# EAGLE design dual_wbo (EAGLE 8.5.1)

## Sheet 1 of 7: MCU
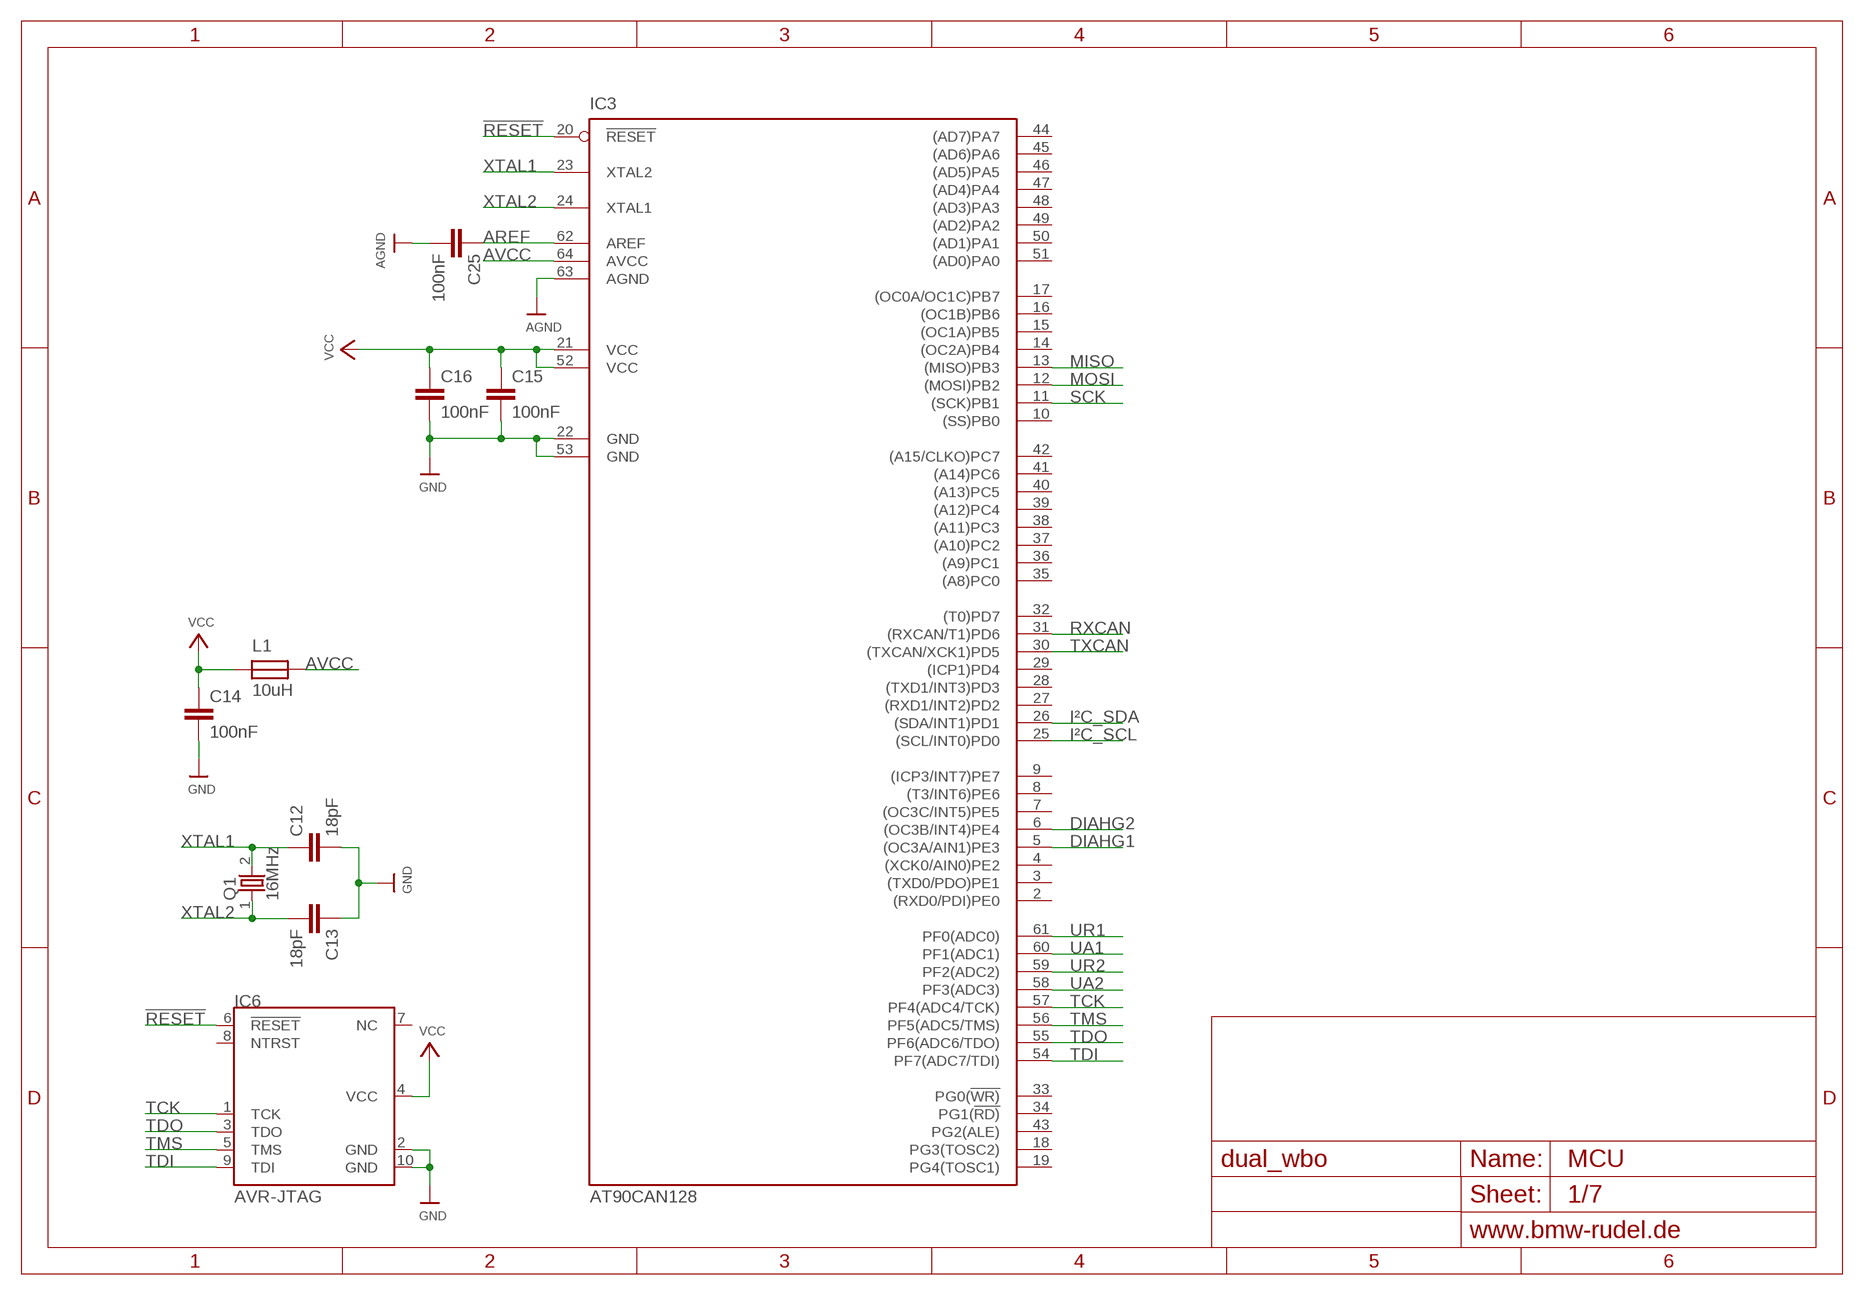
[diagram p0: schematic, sheet 1]

### Parts
C12  18pF  C-EUC0603  [C0603]
C13  18pF  C-EUC0603  [C0603]
C14  100nF  C-EUC0603  [C0603]
C15  100nF  C-EUC0603  [C0603]
C16  100nF  C-EUC0603  [C0603]
C25  100nF  C-EUC0603  [C0603]
IC3  AT90CAN128  [TQFP64]
IC6  AVR-JTAG  [2X05_1.27MM_SMT]
L1  10uH  FERRITE0603  [R0603]
Q1  16MHz  ABM3  [ABM3]

### Nets
!RESET: IC3.20(!RESET) IC6.6(!RESET)
AGND: C25.2 IC3.63(AGND) ; also sheet 2,3,6
AREF: C25.1 IC3.62(AREF) ; also sheet 2,3,6
AVCC: IC3.64(AVCC) L1.2
DIAHG1: IC3.5((OC3A/AIN1)PE3) ; also sheet 2,4
DIAHG2: IC3.6((OC3B/INT4)PE4) ; also sheet 3,4
GND: C12.2 C13.1 C14.2 C15.2 C16.2 IC3.22(GND) IC3.53(GND) IC6.2(GND) IC6.10(GND) ; also sheet 2,3,4,5,6
I²C_SCL: IC3.25((SCL/INT0)PD0) ; also sheet 5
I²C_SDA: IC3.26((SDA/INT1)PD1) ; also sheet 5
MISO: IC3.13((MISO)PB3) ; also sheet 2,3
MOSI: IC3.12((MOSI)PB2) ; also sheet 2,3
RXCAN: IC3.31((RXCAN/T1)PD6) ; also sheet 5
SCK: IC3.11((SCK)PB1) ; also sheet 2,3
TCK: IC3.57(PF4(ADC4/TCK)) IC6.1(TCK)
TDI: IC3.54(PF7(ADC7/TDI)) IC6.9(TDI)
TDO: IC3.55(PF6(ADC6/TDO)) IC6.3(TDO)
TMS: IC3.56(PF5(ADC5/TMS)) IC6.5(TMS)
TXCAN: IC3.30((TXCAN/XCK1)PD5) ; also sheet 5
UA1: IC3.60(PF1(ADC1)) ; also sheet 2
UA2: IC3.58(PF3(ADC3)) ; also sheet 3
UR1: IC3.61(PF0(ADC0)) ; also sheet 2
UR2: IC3.59(PF2(ADC2)) ; also sheet 3
VCC: C14.1 C15.1 C16.1 IC3.21(VCC) IC3.52(VCC) IC6.4(VCC) L1.1 ; also sheet 2,3,5,6
XTAL1: C12.1 IC3.23(XTAL2) Q1.2
XTAL2: C13.2 IC3.24(XTAL1) Q1.1
Unconnected: IC3.2((RXD0/PDI)PE0) IC3.3((TXD0/PDO)PE1) IC3.4((XCK0/AIN0)PE2) IC3.7((OC3C/INT5)PE5) IC3.8((T3/INT6)PE6) IC3.9((ICP3/INT7)PE7) IC3.10((SS)PB0) IC3.14((OC2A)PB4) IC3.15((OC1A)PB5) IC3.16((OC1B)PB6) IC3.17((OC0A/OC1C)PB7) IC3.18(PG3(TOSC2)) IC3.19(PG4(TOSC1)) IC3.27((RXD1/INT2)PD2) IC3.28((TXD1/INT3)PD3) IC3.29((ICP1)PD4) IC3.32((T0)PD7) IC3.33(PG0(!WR)) IC3.34(PG1(!RD)) IC3.35((A8)PC0) IC3.36((A9)PC1) IC3.37((A10)PC2) IC3.38((A11)PC3) IC3.39((A12)PC4) IC3.40((A13)PC5) IC3.41((A14)PC6) IC3.42((A15/CLKO)PC7) IC3.43(PG2(ALE)) IC3.44((AD7)PA7) IC3.45((AD6)PA6) IC3.46((AD5)PA5) IC3.47((AD4)PA4) IC3.48((AD3)PA3) IC3.49((AD2)PA2) IC3.50((AD1)PA1) IC3.51((AD0)PA0) IC6.7(NC) IC6.8(NTRST)

## Sheet 2 of 7: CJ125 #1
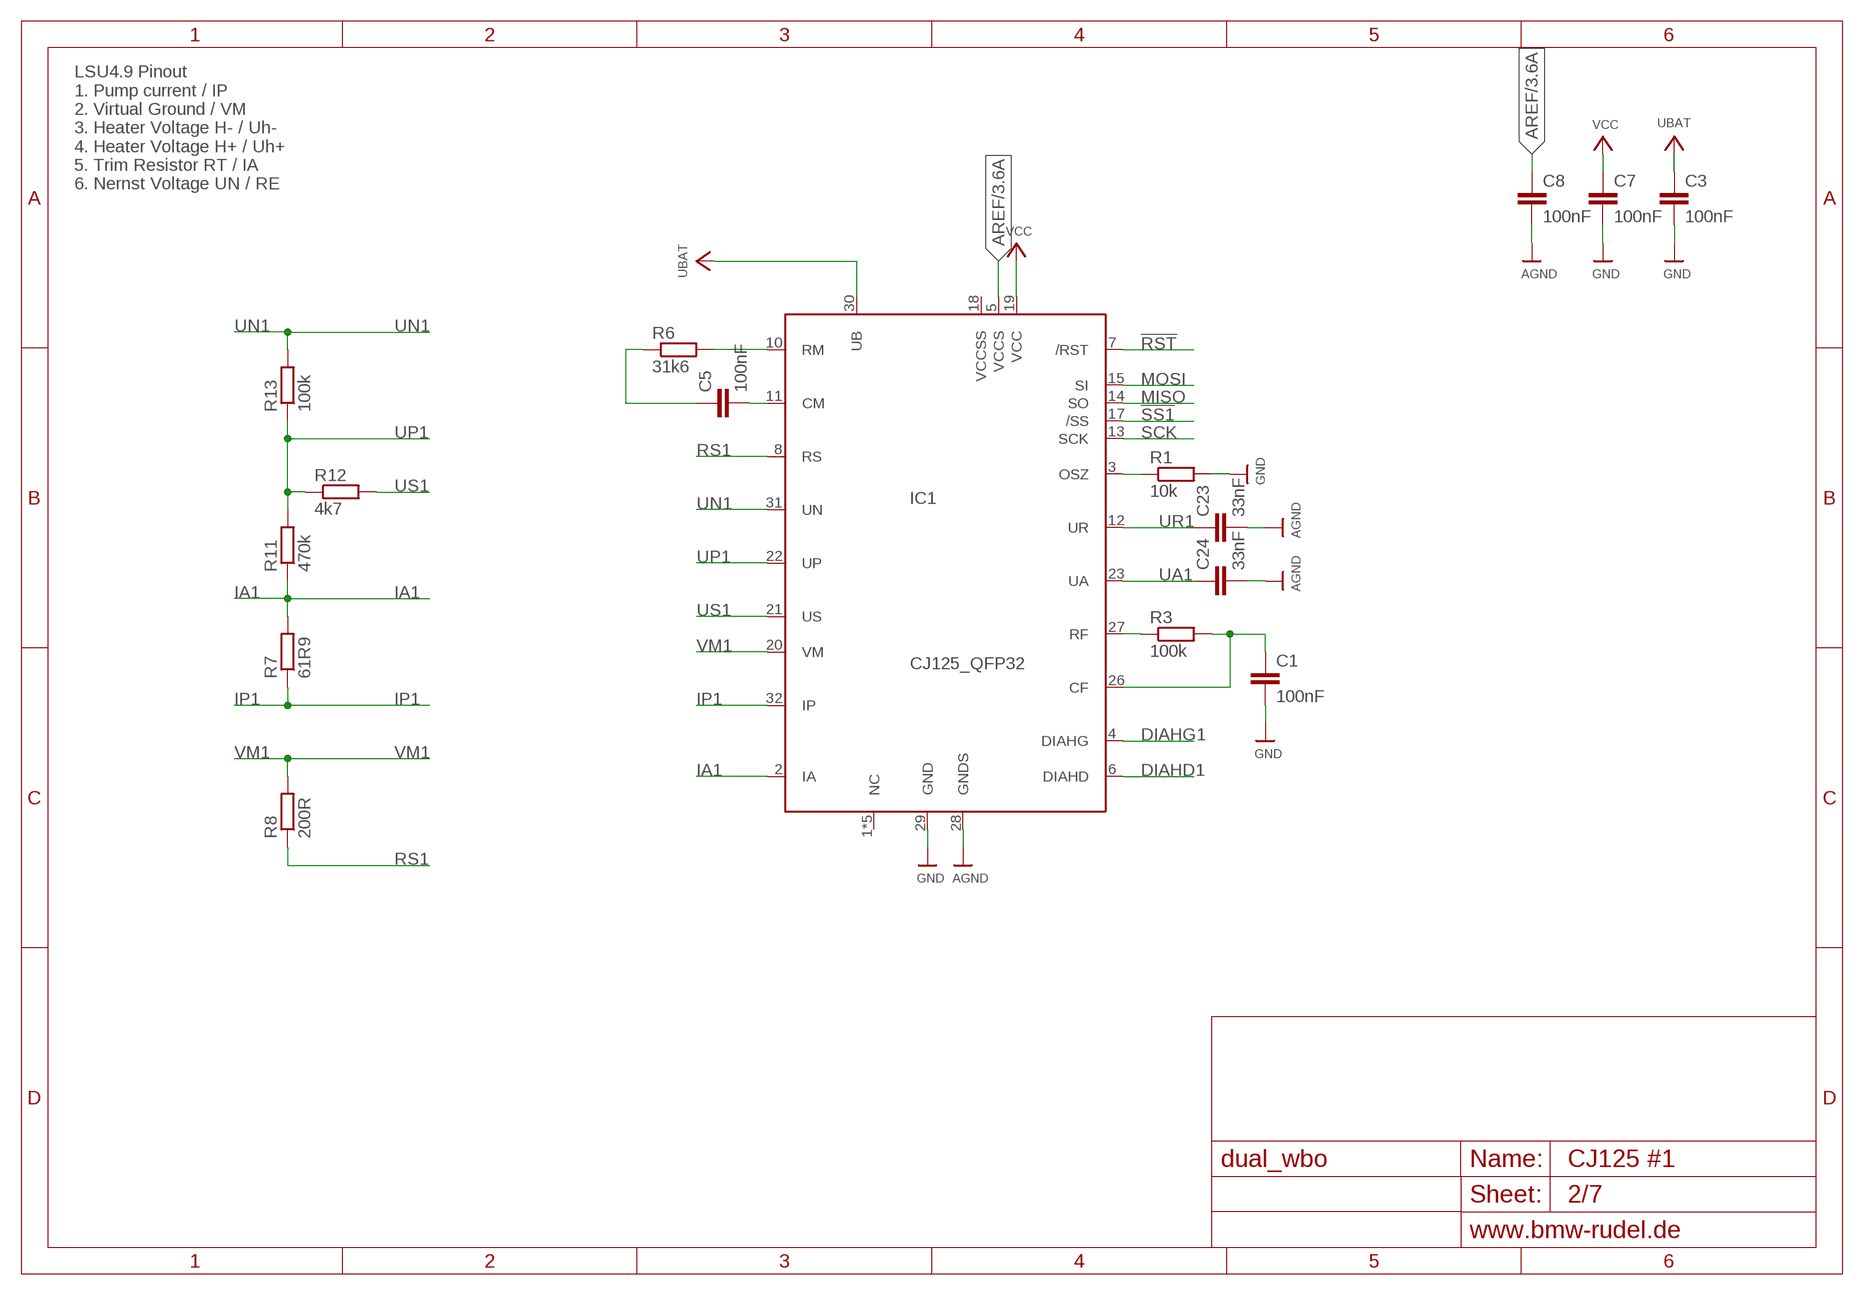
[diagram p1: schematic, sheet 2]

### Parts
C1  100nF  C-EUC0603  [C0603]
C3  100nF  C-EUC0603  [C0603]
C5  100nF  C-EUC0603  [C0603]
C7  100nF  C-EUC0603  [C0603]
C8  100nF  C-EUC0603  [C0603]
C23  33nF  C-EUC0603  [C0603]
C24  33nF  C-EUC0603  [C0603]
IC1  CJ125_QFP32  [TQFP32-08]
R1  10k  R-EU_R0603  [R0603]
R3  100k  R-EU_R0603  [R0603]
R6  31k6  R-EU_R0603  [R0603]
R7  61R9  R-EU_R0603  [R0603]
R8  200R  R-EU_R0603  [R0603]
R11  470k  R-EU_R0603  [R0603]
R12  4k7  R-EU_R0603  [R0603]
R13  100k  R-EU_R0603  [R0603]

### Nets
!RST: IC1.7(/RST) ; also sheet 3
!SS1: IC1.17(/SS)
+UBAT: C3.1 IC1.30(UB) ; supply symbol labelled UBAT ; also sheet 6
AGND: C8.2 C23.2 C24.2 IC1.28(GNDS) ; also sheet 1,3,6
AREF: C8.1 IC1.5(VCCS) ; also sheet 1,3,6
DIAHD1: IC1.6(DIAHD) ; also sheet 4
DIAHG1: IC1.4(DIAHG) ; also sheet 1,4
GND: C1.2 C3.2 C7.2 IC1.29(GND) R1.2 ; also sheet 1,3,4,5,6
IA1: IC1.2(IA) R7.2 R11.1
IP1: IC1.32(IP) R7.1
MISO: IC1.14(SO) ; also sheet 1,3
MOSI: IC1.15(SI) ; also sheet 1,3
N$2: IC1.3(OSZ) R1.1
N$5: IC1.27(RF) R3.1
N$6: C1.1 IC1.26(CF) R3.2
N$9: IC1.10(RM) R6.2
N$10: C5.1 R6.1
N$11: C5.2 IC1.11(CM)
RS1: IC1.8(RS) R8.1
SCK: IC1.13(SCK) ; also sheet 1,3
UA1: C24.1 IC1.23(UA) ; also sheet 1
UN1: IC1.31(UN) R13.2
UP1: IC1.22(UP) R11.2 R12.1 R13.1
UR1: C23.1 IC1.12(UR) ; also sheet 1
US1: IC1.21(US) R12.2
VCC: C7.1 IC1.19(VCC) ; also sheet 1,3,5,6
VM1: IC1.20(VM) R8.2
Unconnected: IC1.1(NC) IC1.9(NC) IC1.16(NC) IC1.18(VCCSS) IC1.24(NC) IC1.25(NC)

### Notes on the sheet
- LSU4.9 Pinout
  1. Pump current / IP
  2. Virtual Ground / VM
  3. Heater Voltage H- / Uh-
  4. Heater Voltage H+ / Uh+
  5. Trim Resistor RT / IA
  6. Nernst Voltage UN / RE

## Sheet 3 of 7: CJ125 #2
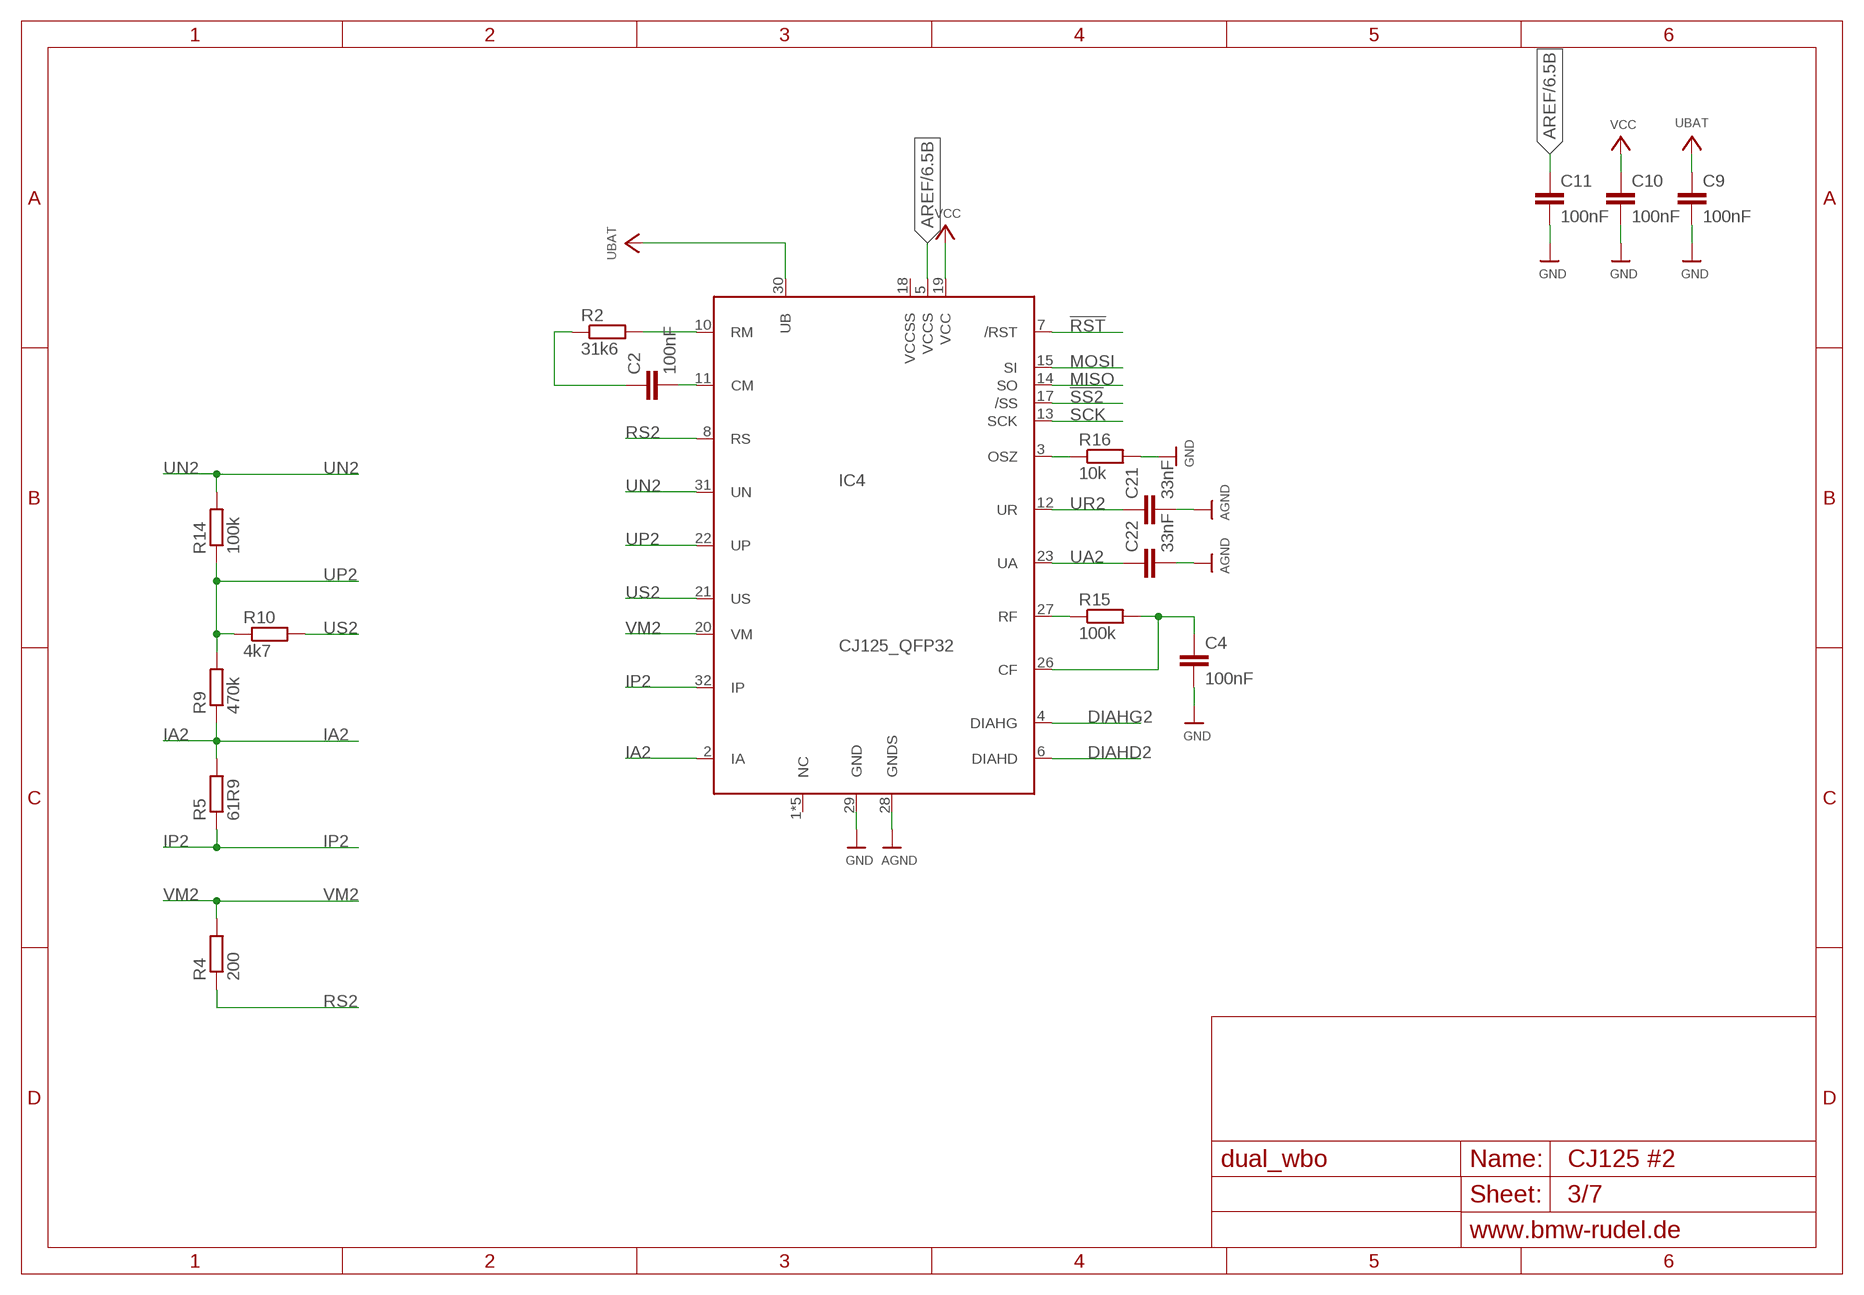
[diagram p2: schematic, sheet 3]

### Parts
C2  100nF  C-EUC0603  [C0603]
C4  100nF  C-EUC0603  [C0603]
C9  100nF  C-EUC0603  [C0603]
C10  100nF  C-EUC0603  [C0603]
C11  100nF  C-EUC0603  [C0603]
C21  33nF  C-EUC0603  [C0603]
C22  33nF  C-EUC0603  [C0603]
IC4  CJ125_QFP32  [TQFP32-08]
R2  31k6  R-EU_R0603  [R0603]
R4  200  R-EU_R0603  [R0603]
R5  61R9  R-EU_R0603  [R0603]
R9  470k  R-EU_R0603  [R0603]
R10  4k7  R-EU_R0603  [R0603]
R14  100k  R-EU_R0603  [R0603]
R15  100k  R-EU_R0603  [R0603]
R16  10k  R-EU_R0603  [R0603]

### Nets
!RST: IC4.7(/RST) ; also sheet 2
!SS2: IC4.17(/SS)
AGND: C21.2 C22.2 IC4.28(GNDS) ; also sheet 1,2,6
AREF: C11.1 IC4.5(VCCS) ; also sheet 1,2,6
DIAHD2: IC4.6(DIAHD) ; also sheet 4
DIAHG2: IC4.4(DIAHG) ; also sheet 1,4
GND: C4.2 C9.2 C10.2 C11.2 IC4.29(GND) R16.2 ; also sheet 1,2,4,5,6
IA2: IC4.2(IA) R5.2 R9.1
IP2: IC4.32(IP) R5.1
MISO: IC4.14(SO) ; also sheet 1,2
MOSI: IC4.15(SI) ; also sheet 1,2
N$4: C2.1 R2.1
N$7: IC4.27(RF) R15.1
N$8: C4.1 IC4.26(CF) R15.2
N$18: C2.2 IC4.11(CM)
N$19: IC4.10(RM) R2.2
N$20: IC4.3(OSZ) R16.1
RS2: IC4.8(RS) R4.1
SCK: IC4.13(SCK) ; also sheet 1,2
UA2: C22.1 IC4.23(UA) ; also sheet 1
UN2: IC4.31(UN) R14.2
UP2: IC4.22(UP) R9.2 R10.1 R14.1
UR2: C21.1 IC4.12(UR) ; also sheet 1
US2: IC4.21(US) R10.2
VBAT: C9.1 IC4.30(UB) ; supply symbol labelled UBAT
VCC: C10.1 IC4.19(VCC) ; also sheet 1,2,5,6
VM2: IC4.20(VM) R4.2
Unconnected: IC4.1(NC) IC4.9(NC) IC4.16(NC) IC4.18(VCCSS) IC4.24(NC) IC4.25(NC)

## Sheet 4 of 7: Heater Control
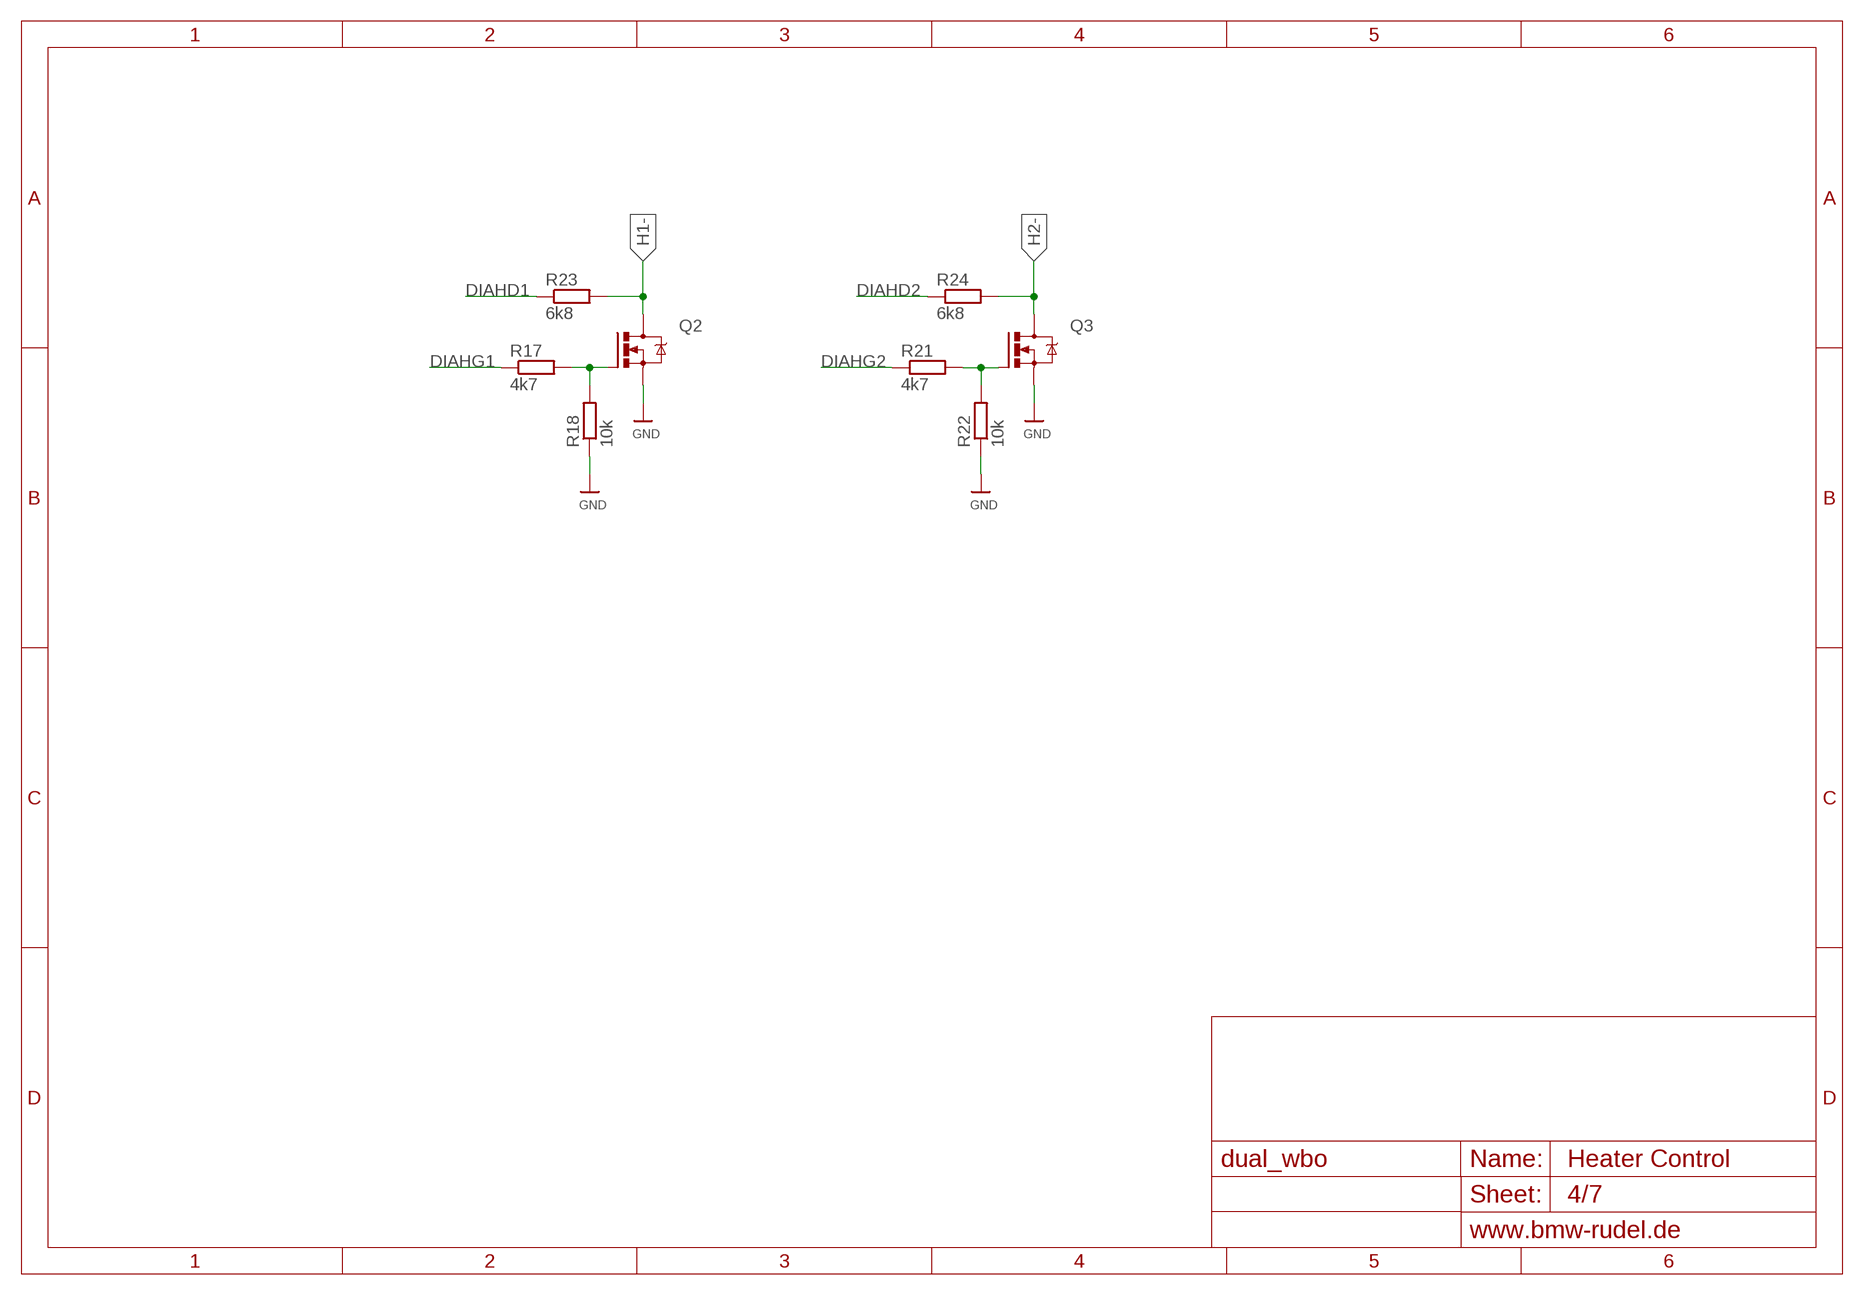
[diagram p3: schematic, sheet 4]

### Parts
Q2  N_MOSFETTO252  [TO252]
Q3  N_MOSFETTO252  [TO252]
R17  4k7  R-EU_R0603  [R0603]
R18  10k  R-EU_R0603  [R0603]
R21  4k7  R-EU_R0603  [R0603]
R22  10k  R-EU_R0603  [R0603]
R23  6k8  R-EU_R0603  [R0603]
R24  6k8  R-EU_R0603  [R0603]

### Nets
DIAHD1: R23.1 ; also sheet 2
DIAHD2: R24.1 ; also sheet 3
DIAHG1: R17.1 ; also sheet 1,2
DIAHG2: R21.1 ; also sheet 1,3
GND: Q2.3(S) Q3.3(S) R18.1 R22.1 ; also sheet 1,2,3,5,6
H1-: Q2.2(D) R23.2
H2-: Q3.2(D) R24.2
N$1: Q2.1(G) R17.2 R18.2
N$3: Q3.1(G) R21.2 R22.2

## Sheet 5 of 7: CAN & DAC
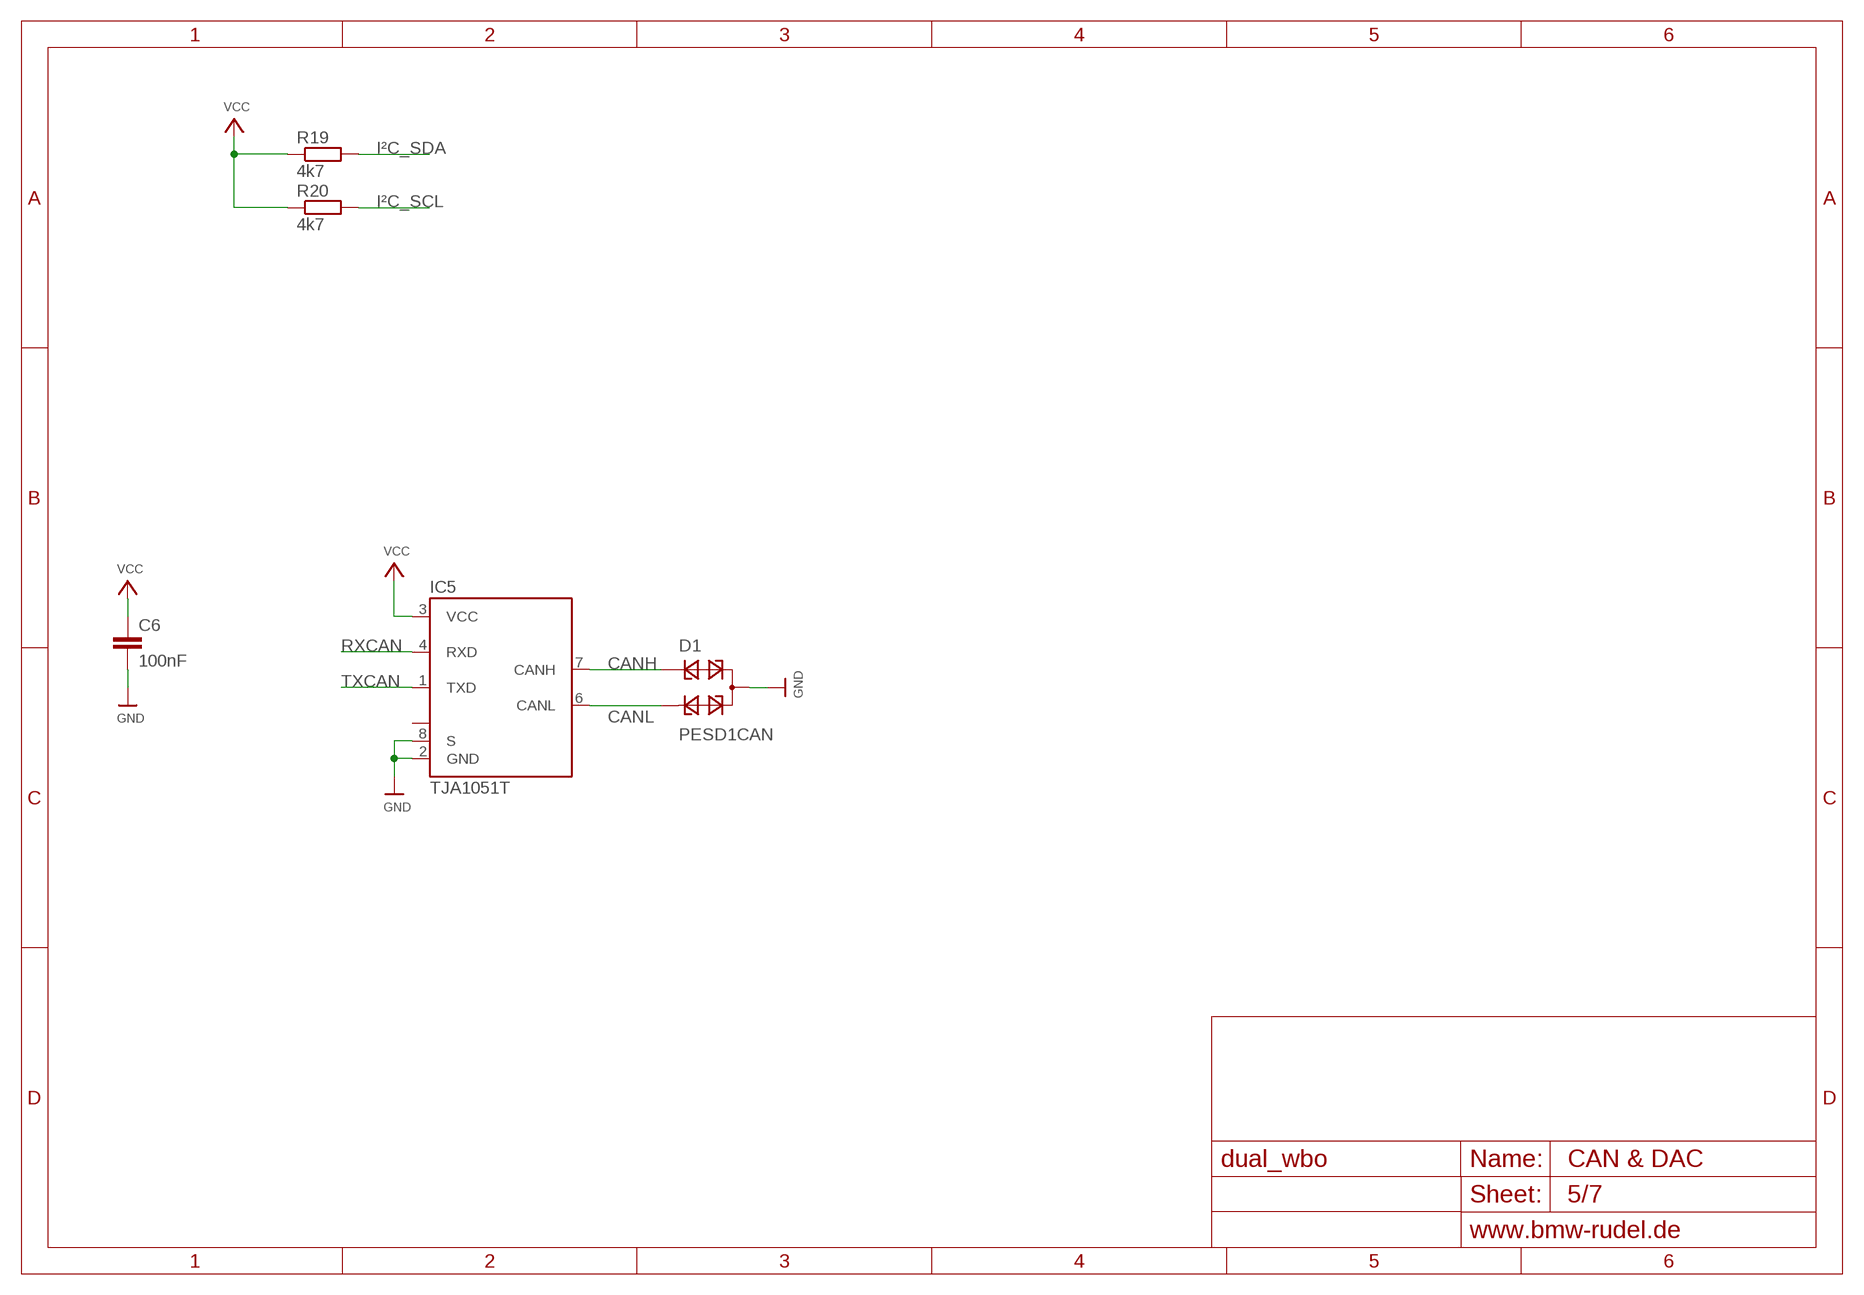
[diagram p4: schematic, sheet 5]

### Parts
C6  100nF  C-EUC0603  [C0603]
D1  PESD1CAN  [SOT23]
IC5  TJA1051T  [SO8]
R19  4k7  R-EU_R0603  [R0603]
R20  4k7  R-EU_R0603  [R0603]

### Nets
CANH: D1.1 IC5.7(CANH)
CANL: D1.2 IC5.6(CANL)
GND: C6.2 D1.3 IC5.2(GND) IC5.8(S) ; also sheet 1,2,3,4,6
I²C_SCL: R20.2 ; also sheet 1
I²C_SDA: R19.2 ; also sheet 1
RXCAN: IC5.4(RXD) ; also sheet 1
TXCAN: IC5.1(TXD) ; also sheet 1
VCC: C6.1 IC5.3(VCC) R19.1 R20.1 ; also sheet 1,2,3,6
Unconnected: IC5.5(N.C.)

## Sheet 6 of 7: PSU
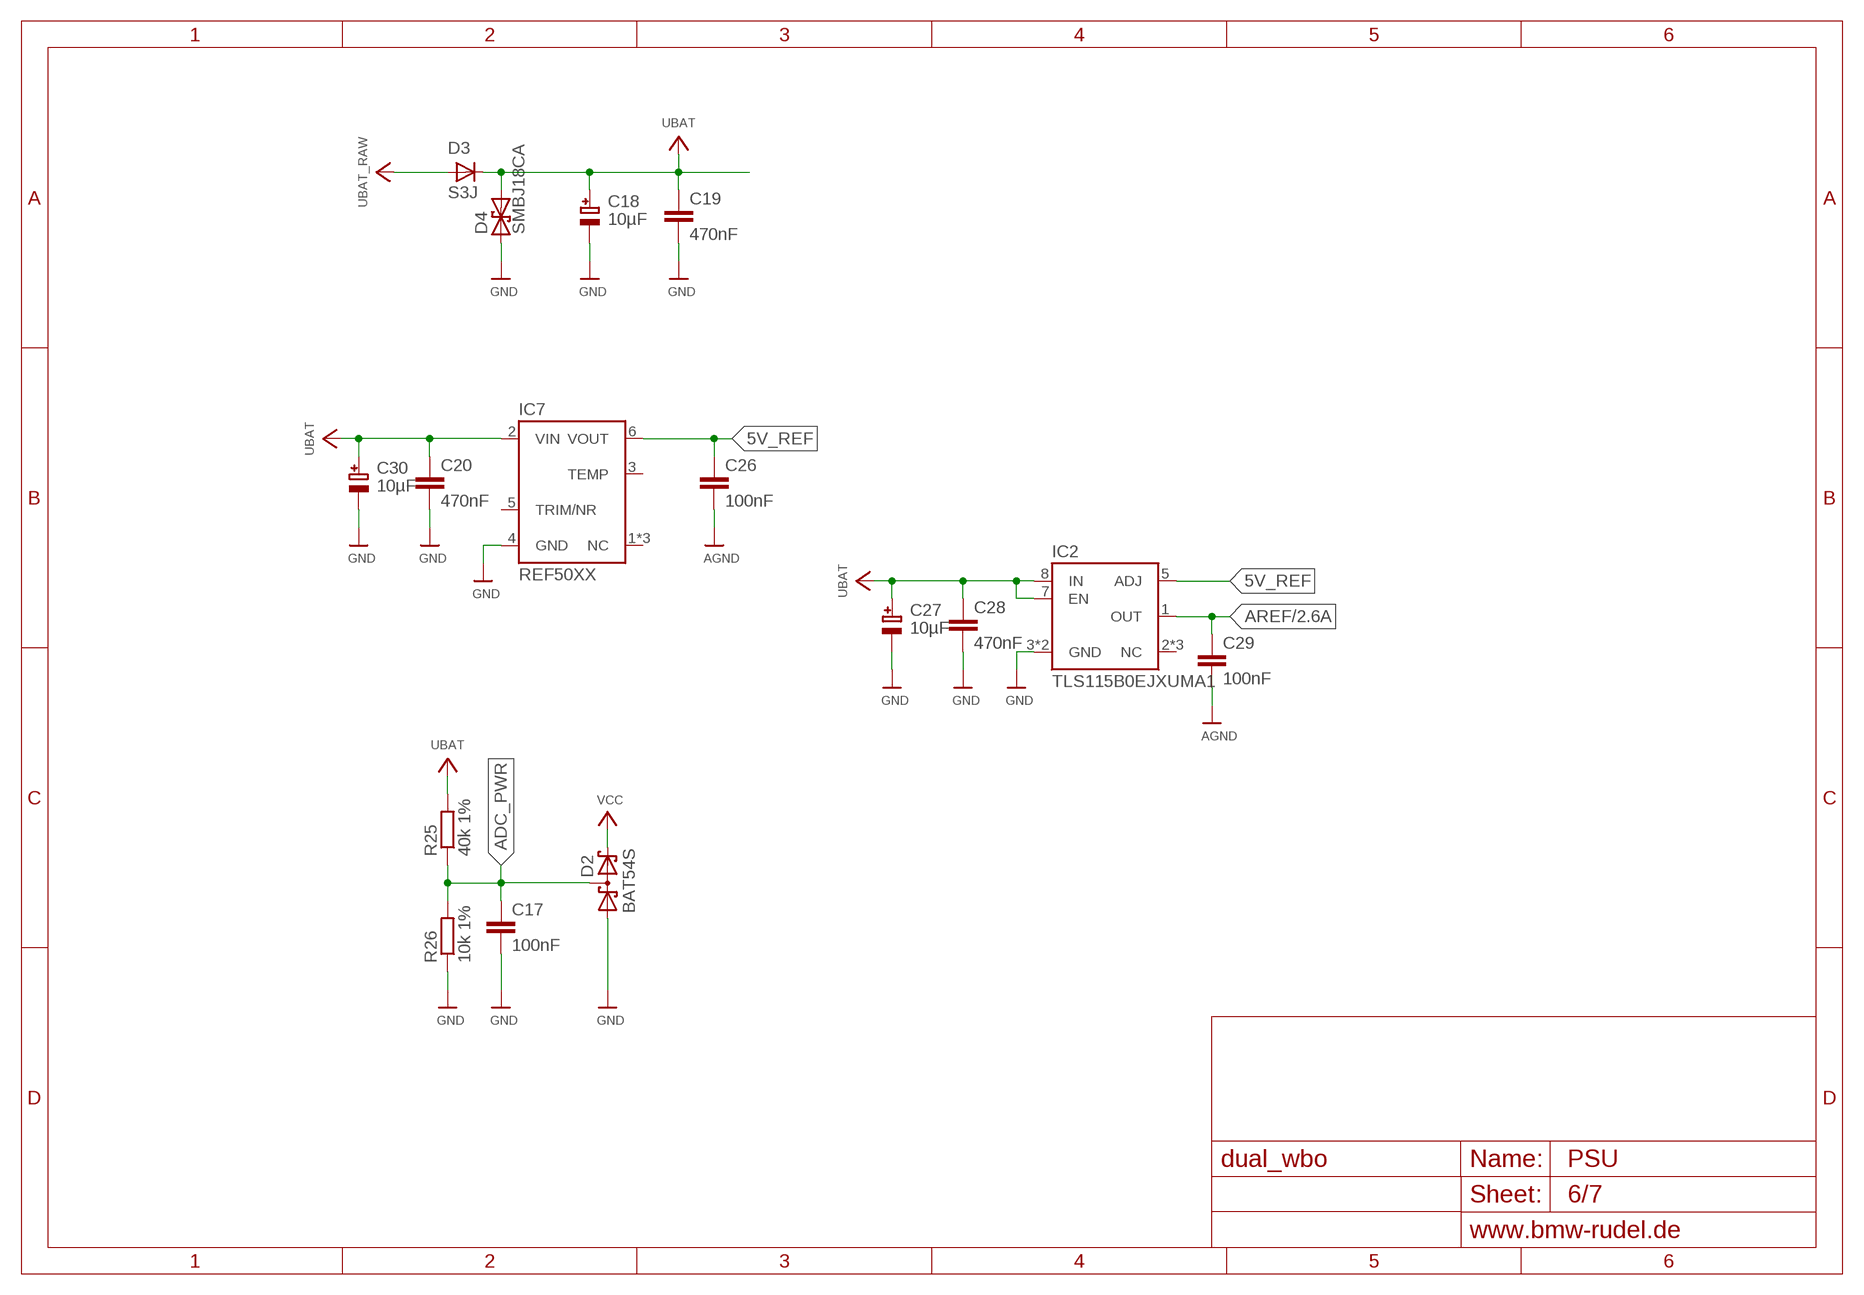
[diagram p5: schematic, sheet 6]

### Parts
C17  100nF  C-EUC0603  [C0603]
C18  10µF  CAP_TANTALUMSMCC  [SMC_C]
C19  470nF  C-EUC0805  [C0805]
C20  470nF  C-EUC0603  [C0603]
C26  100nF  C-EUC0603  [C0603]
C27  10µF  CAP_TANTALUMSMCC  [SMC_C]
C28  470nF  C-EUC0603  [C0603]
C29  100nF  C-EUC0603  [C0603]
C30  10µF  CAP_TANTALUMSMCC  [SMC_C]
D2  BAT54S  [SOT23]
D3  S3J  DIODESMB  [SMB]
D4  SMBJ18CA  P6SMBXXCA  [DO214AA]
IC2  TLS115B0EJXUMA1  [SOIC127P600X170-9N]
IC7  REF50XX  [SOIC127P600X175-8N]
R25  40k 1%  R-EU_R0603  [R0603]
R26  10k 1%  R-EU_R0603  [R0603]

### Nets
5V_REF: C26.1 IC2.5(ADJ) IC7.6(VOUT)
+UBAT: C18.+ C19.1 C20.1 C27.+ C28.1 C30.+ D3.A(C) D3.C(A) D4.C IC2.7(EN) IC2.8(IN) IC7.2(VIN) R25.2 ; supply symbol labelled UBAT_RAW, UBAT ; also sheet 2
ADC_PWR: C17.1 D2.3(C1A2) R25.1 R26.2
AGND: C26.2 C29.2 ; also sheet 1,2,3
AREF: C29.1 IC2.1(OUT) ; also sheet 1,2,3
GND: C17.2 C18.- C19.2 C20.2 C27.- C28.2 C30.- D2.1(A1) D4.A IC2.3(GND) IC2.9(GND) IC7.4(GND) R26.1 ; also sheet 1,2,3,4,5
VCC: D2.2(C2) ; also sheet 1,2,3,5
Unconnected: IC2.2(NC) IC2.4(NC) IC2.6(NC) IC7.1(NC) IC7.3(TEMP) IC7.5(TRIM/NR) IC7.7(NC) IC7.8(NC)

## Sheet 7 of 7: Connector
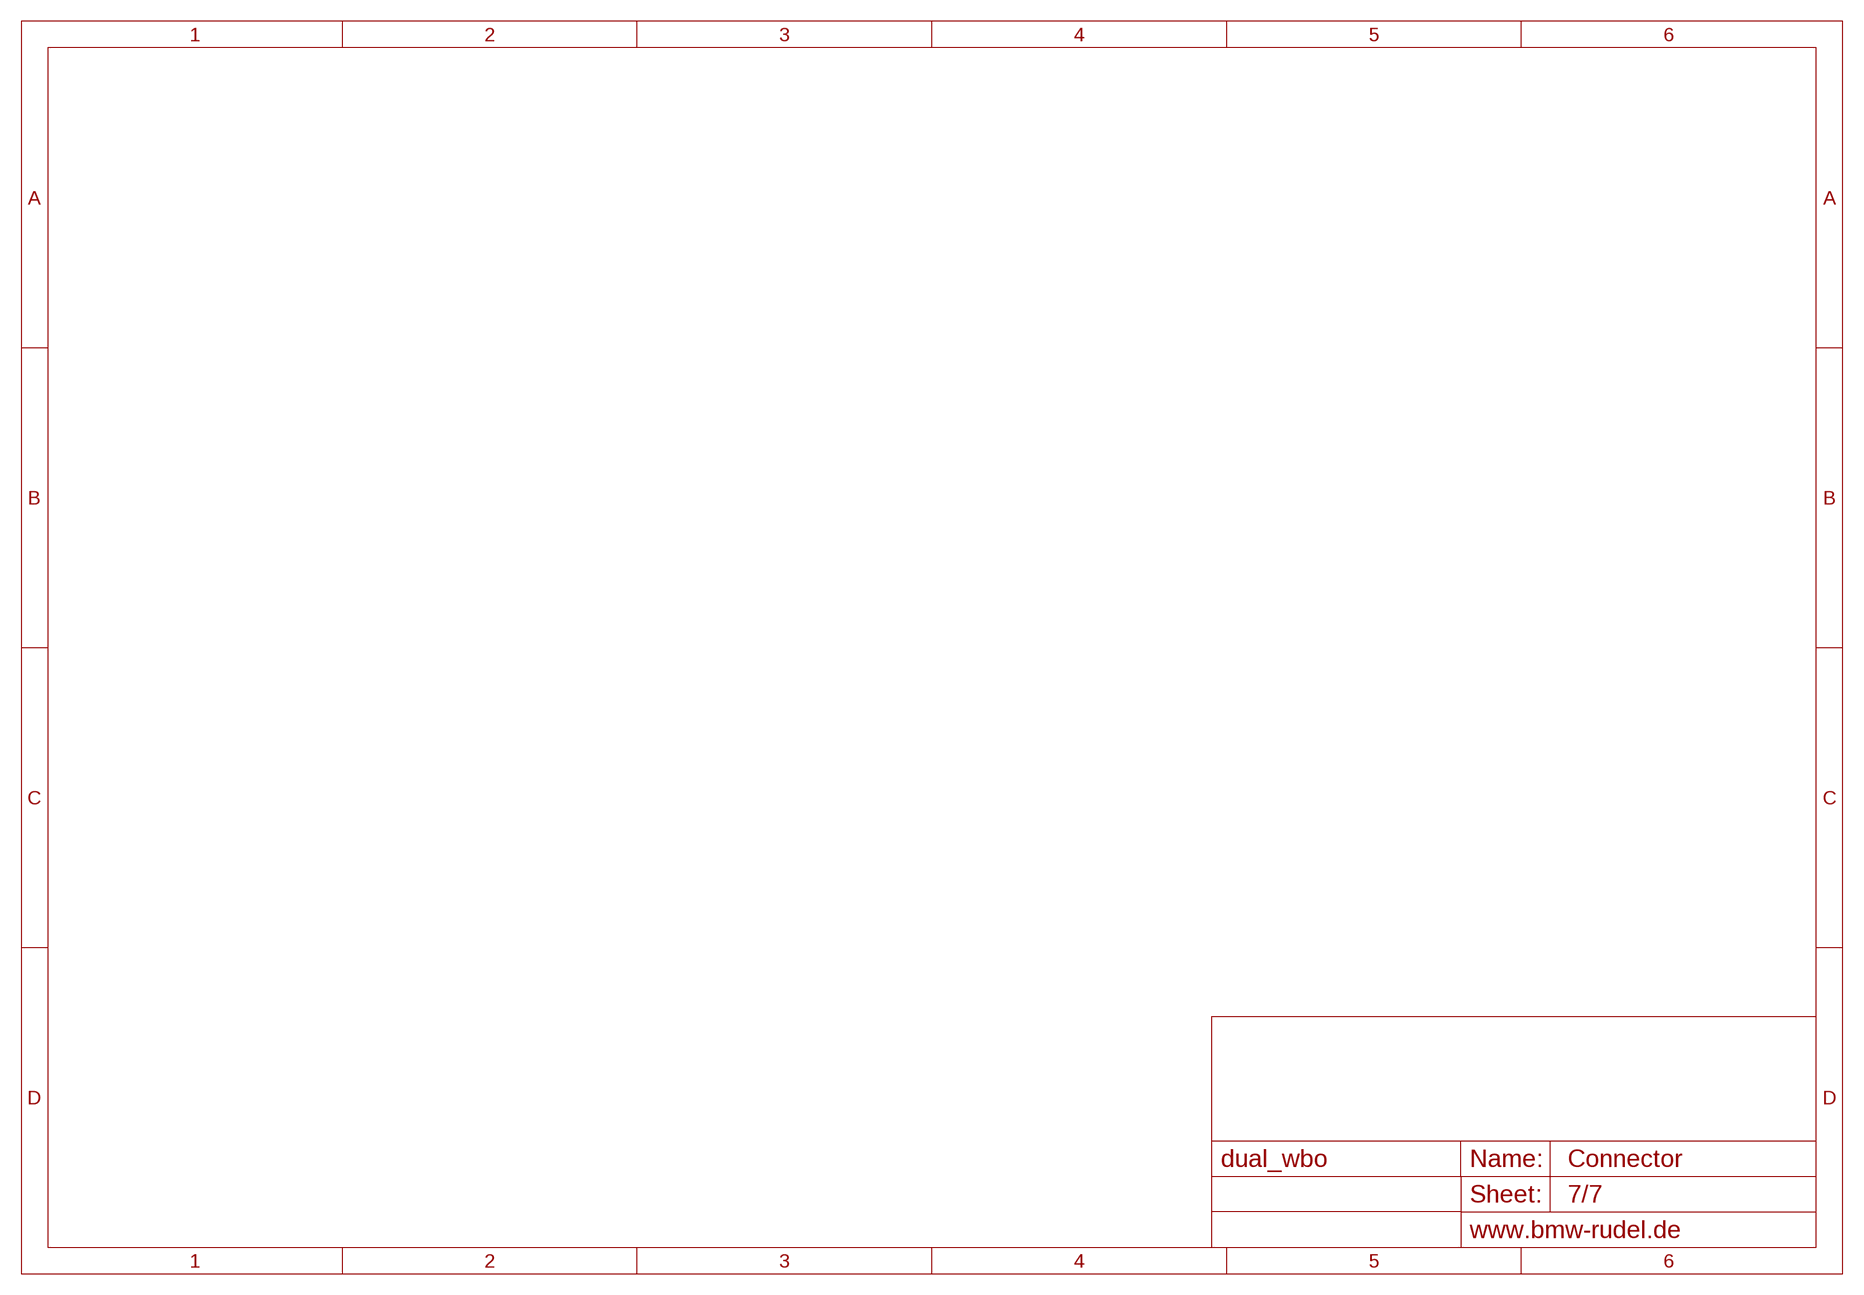
[diagram p6: schematic, sheet 7]

## Library data of the parts
C1-C17 C19-C26 C28 C29 = rcl:C-EU: CAPACITOR, European symbol; SPICEPREFIX: C
C18 C27 C30 = Heinrich:CAP_TANTALUM: Tantalum Capacitors Wave footprints have larger pads and are meant to be used for hand soldering. EIA3216-18/A-[W] - Size A / 3216-18 / 1206 footprint 4.7?F 25V 10% Tantalum Capacitor 10?F 16V 10% Tantalum Capacitor [Digikey: 495-2236-2-ND] EIA3528-21/B-[W] - Size B / 3528-21 47?F 10V 10% Tantalum Capactior [Digikey: 495-2216-1-ND] EIA6032-28/C-[W] - Size C / 6032-28 10?F 35V 20% Tantalum Capacitor [Digikey: 495-2285-1-ND] 100?F 16V 10% Tantalum Capactior [Digikey: 399-5214-1-ND]
D1 = diode:PESD1CAN: CAN bus ESD protection diode Source: http://www.nxp.com/documents/data_sheet/PESD1CAN.pdf
D2 = diode:BAT54S: Schottky Diodes Pin connection corrected 2011-05-04 Source: Fairchild .. BAT54.pdf
D3 = Heinrich:DIODE: Diode SMADIODE - SMA Surface Mount Package 20V 1A Schottky Diode Digikey (500mV @ 1A, 500uA Vr @ 20V): 641-1014-6-ND SOD-123 30V 500mA (430mV Vf, 130uA Vr @ 30V) Schottky Diode - Digikey: B0530W-FDICT-ND SOD-323 10V 570mA (380mV Vf, 3ns) Schottky Diode - Digikey: ZLLS410CT-ND SOD-523 30V 30mA Schottky Diode (RB751S-40TE61) - Digikey: RB751S-40TE61CT-ND SOT23-R/W - SOT23 Package (R = Solder Paste/Reflow Ovens, W = Hand-Soldering) BAT54Film 40V 300mA - Digikey: 497-7162-1-ND DO-1N4148 Through Hole Small Current Diode (any model)
D4 = Heinrich:P6SMBXXCA: TVS Diode Bi-Directional, i.e. Littlefuse SMBJXXCA
IC1 IC4 = Heinrich:CJ125_QFP32: Bosch CJ125 Lambda Controller IC in QFP32 Package
IC2 = Heinrich:TLS115B0EJXUMA1: INFINEON - TLS115B0EJXUMA1 - LINEAR VOLTAGE REGULATOR Source: Datasheet <https://datasheet.datasheetarchive.com/originals/distributors/DKDS-40/45612.pdf>; ARROW_PART_NUMBER: TLS115B0EJXUMA1; ARROW_PRICE-STOCK: https://www.arrow.com/en/products/tls115b0ejxuma1/infineon-technologies-ag; DESCRIPTION: INFINEON - TLS115B0EJXUMA1 - LINEAR VOLTAGE REGULATOR; HEIGHT: 1.7mm; MANUFACTURER_NAME: Infineon; MANUFACTURER_PART_NUMBER: TLS115B0EJXUMA1; MOUSER_PART_NUMBER: 726-TLS115B0EJXUMA1; MOUSER_PRICE-STOCK: https://www.mouser.co.uk/ProductDetail/Infineon-Technologies/TLS115B0EJXUMA1?qs=Qyx3PVvfm669%2FyRQa%2FG9Ew%3D%3D
IC3 = Heinrich:AT90CAN128
IC5 = Heinrich:TJA1051T
IC6 = Heinrich:AVR-JTAG
IC7 = Heinrich:REF50XX: 3 Vpp/V Noise, 3 ppm/C Drift Precision Series Voltage Reference Source: Datasheet <http://www.ti.com/general/docs/lit/getliterature.tsp?genericPartNumber=REF5050&fileType=pdf>; DESCRIPTION: 3 Vpp/V Noise, 3 ppm/C Drift Precision Series Voltage Reference; HEIGHT: 1.75mm; MANUFACTURER_NAME: Texas Instruments; MANUFACTURER_PART_NUMBER: REF5050AIDR; MOUSER_PART_NUMBER: 595-REF5050AIDR; MOUSER_PRICE-STOCK: https://www.mouser.com/Search/Refine.aspx?Keyword=595-REF5050AIDR
L1 = Heinrich:FERRITE: Ferrite Bead 0603 120 Ohm, 600mA Ferrite Chip - Digikey: 445-2164-1-ND
Q1 = Heinrich:ABM3: Abracon ABM3 series smd crystal, smaller alternative for ABM7 series 8MHz to 54MHz fundamental frequency range 54.100MHz to 80MHz 3rd overtone frequency range Source: Datasheet <https://abracon.com/Resonators/abm3.pdf>; ARROW_PART_NUMBER: ABM3-8.000MHZ-D2Y-T; ARROW_PRICE-STOCK: https://www.arrow.com/en/products/abm3-8.000mhz-d2y-t/abracon?region=nac; DESCRIPTION: Abracon 6 MHz, 8 MHz Crystal +/-20 ppm, +/-30 ppm 2-SMD, HC49/US, No Lead; HEIGHT: 1mm; MANUFACTURER_NAME: ABRACON; MANUFACTURER_PART_NUMBER: ABM3-8.000MHZ-D2Y-T; MOUSER_PART_NUMBER: 815-ABM3-8-D2Y-T; MOUSER_PRICE-STOCK: https://www.mouser.co.uk/ProductDetail/ABRACON/ABM3-8000MHZ-D2Y-T?qs=ihRgKfnEsN4giUXjc3yS1g%3D%3D
Q2 Q3 = Heinrich:N_MOSFET
R1-R26 = rcl:R-EU_: RESISTOR, European symbol; SPICEPREFIX: R

## Board
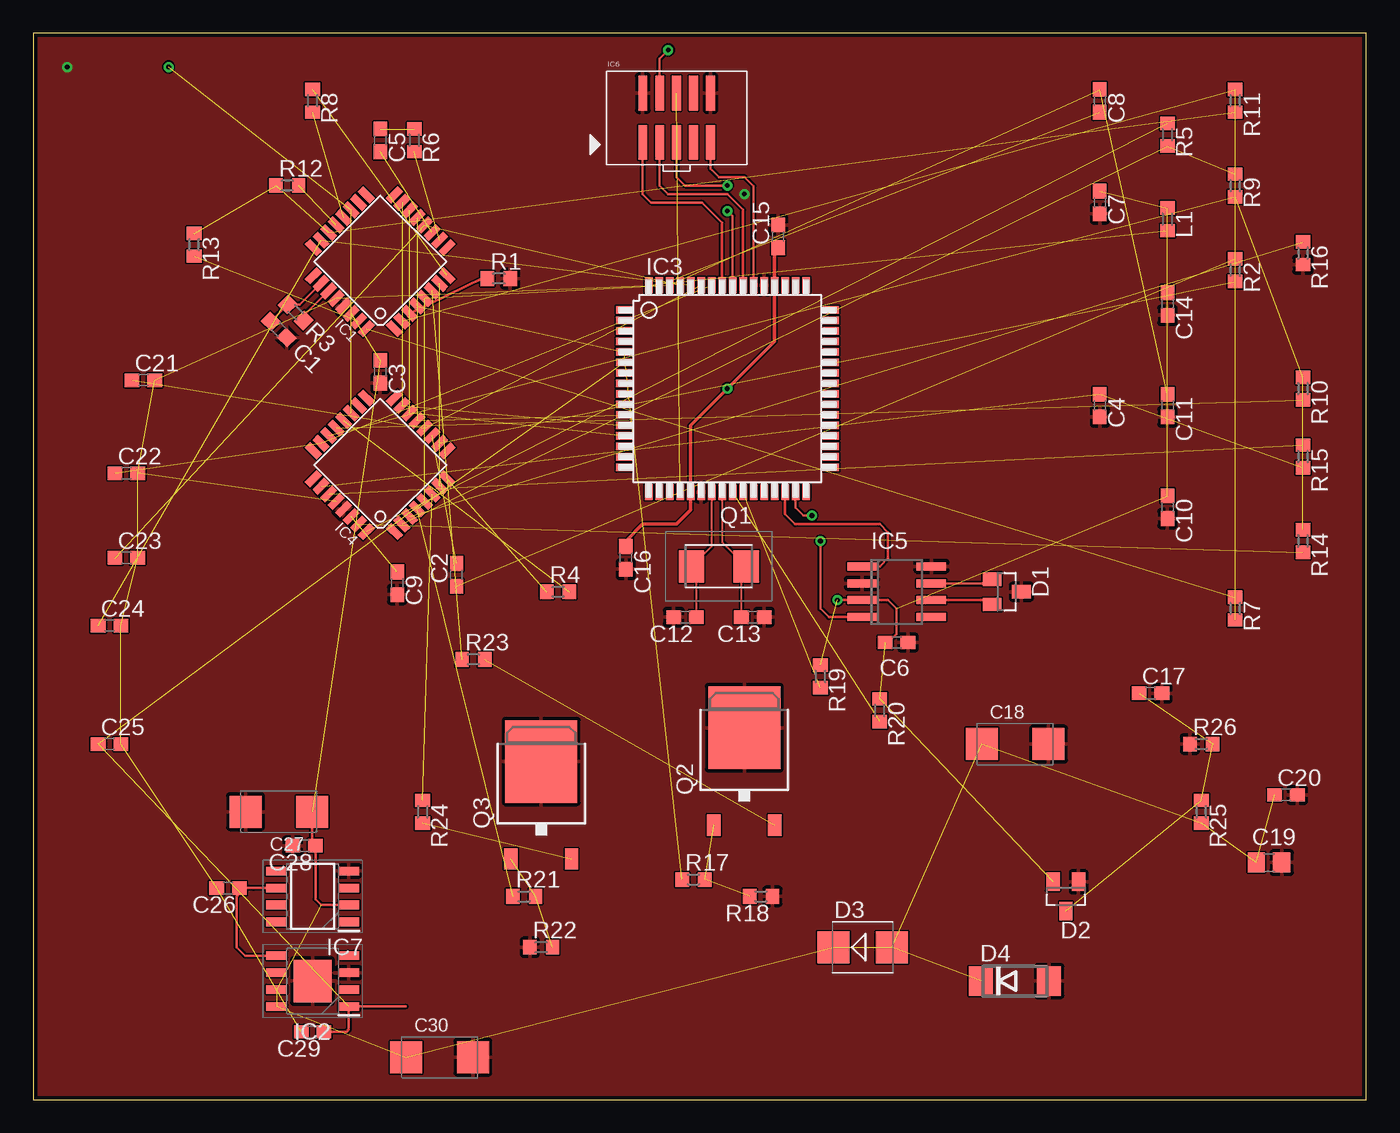
[diagram p7: board, top side]
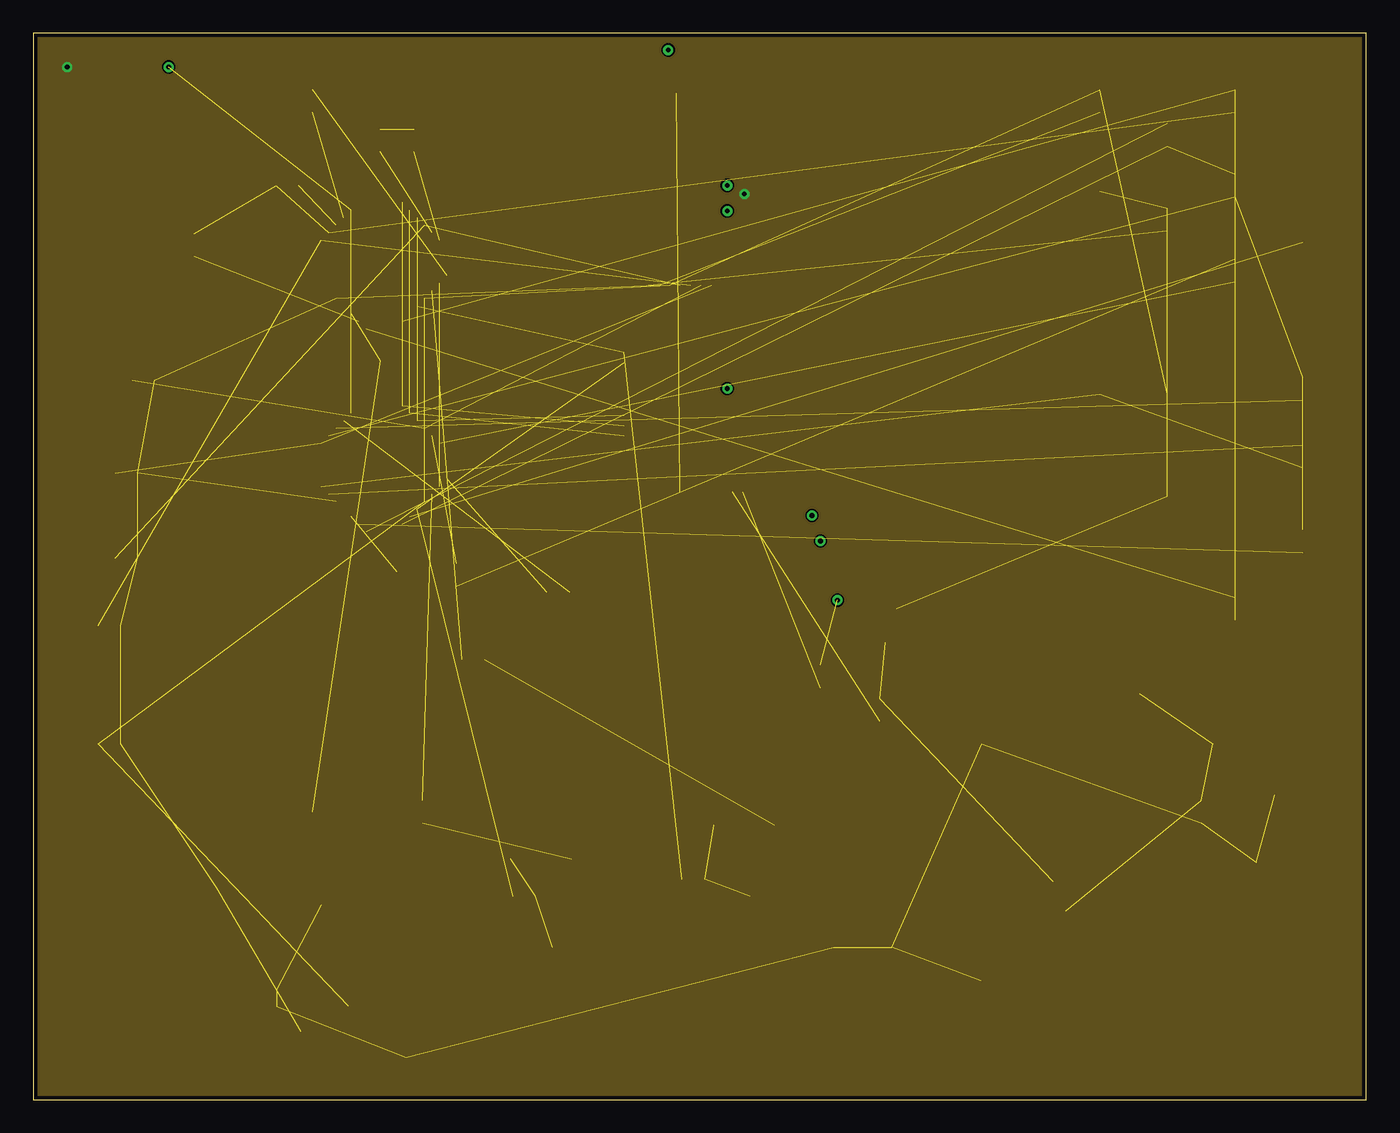
[diagram p8: board, inner layer Route2]
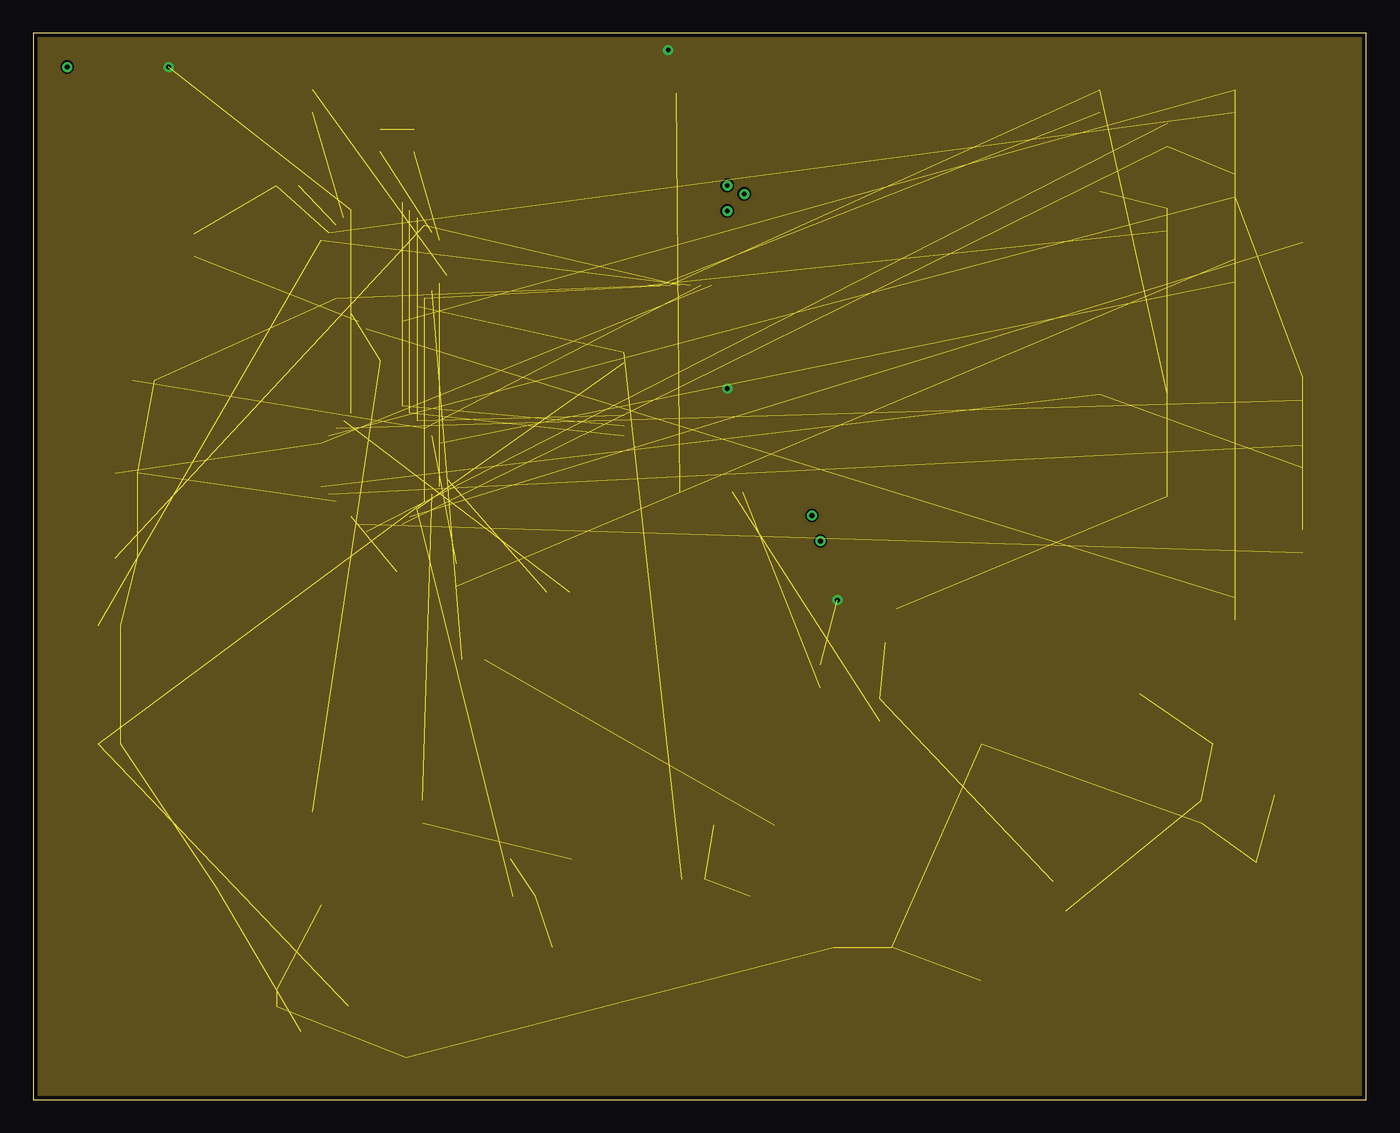
[diagram p9: board, inner layer Route15]
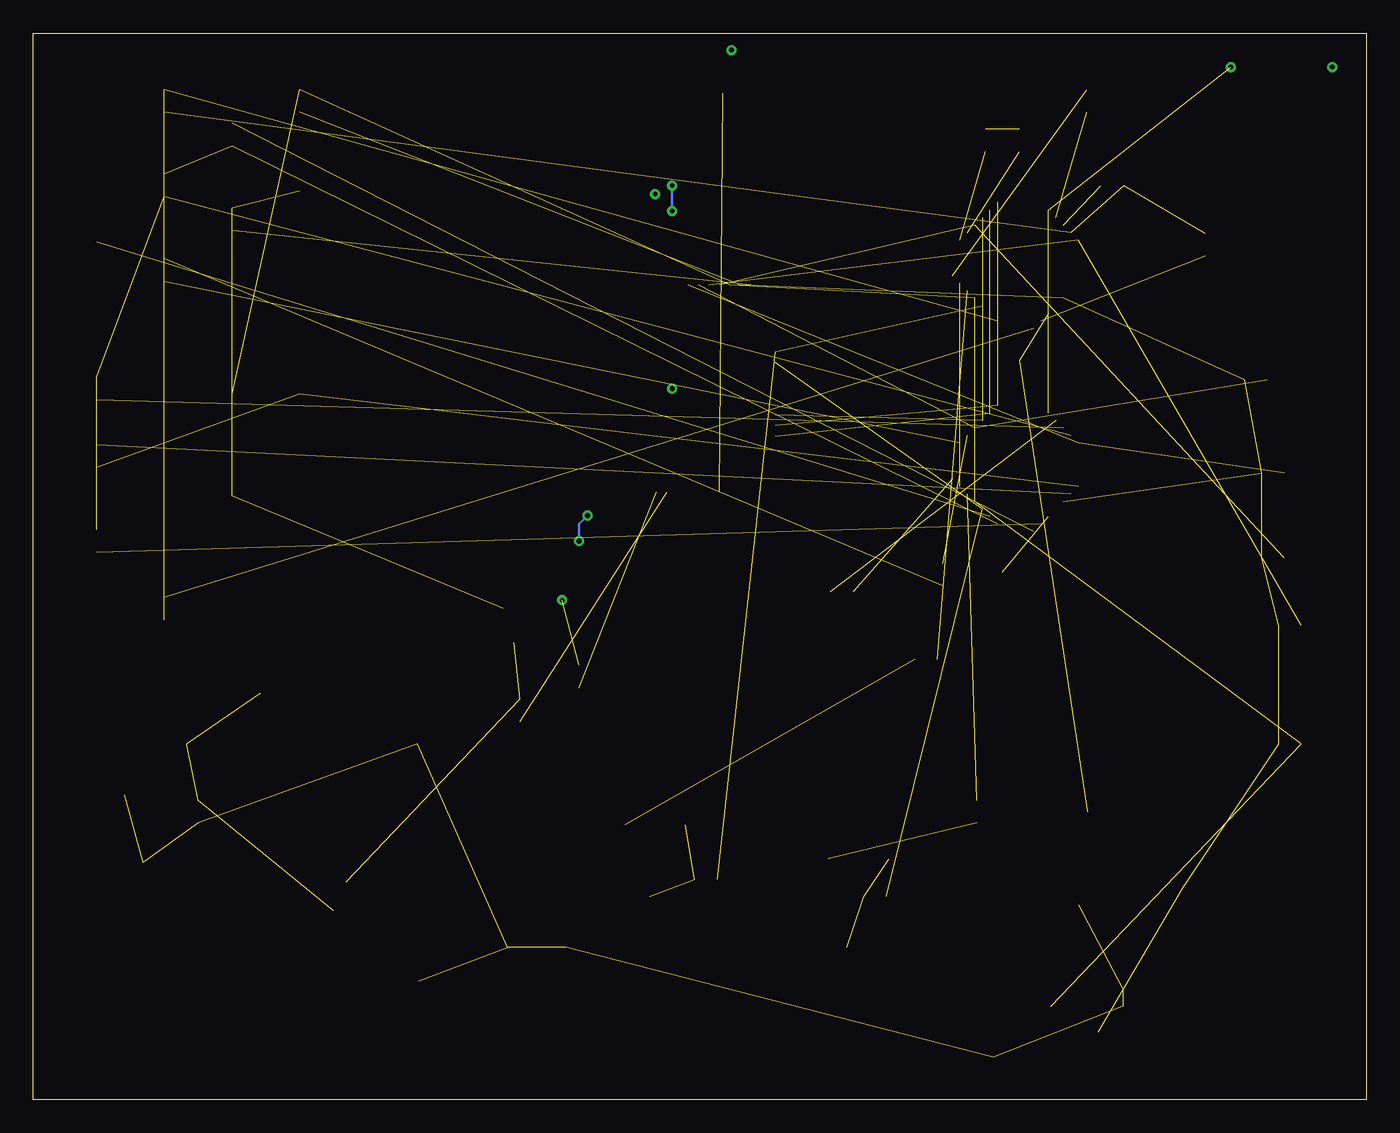
[diagram p10: board, bottom side, seen from below]

Size 100 x 80 mm. Coordinates in mm from the lower left corner, seen from the top.
Outline: 0,0 100,0 100,80 0,80 0,0
Copper layers (1+2*15+16): Top 0.035mm / dielectric 0.2mm / Route2 0.018mm / dielectric 1.5mm / Route15 0.018mm / dielectric 0.2mm / Bottom 0.035mm
Design rules "aisler_4_layer_complex": minimum track width 0.125mm, minimum drill 0.2mm, track to track 0.125mm, track to pad 0.125mm, pad to pad 0.125mm, via to via 0.125mm, smd to smd 0.125mm, copper to edge 0.3mm, drill to drill 0.25mm, minimum pad ring 0.2mm, minimum via ring 0.2mm, stop-mask expansion 0mil, vias tented up to drill 0mil, thermal gap 10mil

### Footprints (pad centres in the part's own frame; a part is rotated, then mirrored left to right if it is on the bottom)
C0603 = smd 1.1 x 1: 1 -0.85,0; 2 0.85,0
SMC_C = smd 2.4 x 2.4: + -2.5,0; - 2.5,0
C0805 = smd 1.3 x 1.5: 1 -0.95,0; 2 0.95,0
SOT23 = smd 1 x 1.4: 1 -0.95,-1.1; 2 0.95,-1.1; 3 0,1.1
SMB = smd 2.4 x 2.4: A 2.2,0; C -2.2,0
DO214AA = smd 1.8 x 2.2: A 2.55,0; C -2.55,0
TQFP32-08 = smd 1.27 x 0.559: 1 -4.293,2.8; 2 -4.293,2; 3 -4.293,1.2; 4 -4.293,0.4; 5 -4.293,-0.4; 6 -4.293,-1.2; 7 -4.293,-2; 8 -4.293,-2.8; 17 4.293,-2.8; 18 4.293,-2; 19 4.293,-1.2; 20 4.293,-0.4; 21 4.293,0.4; 22 4.293,1.2; 23 4.293,2; 24 4.293,2.8 | smd 0.559 x 1.27: 9 -2.8,-4.293; 10 -2,-4.293; 11 -1.2,-4.293; 12 -0.4,-4.293; 13 0.4,-4.293; 14 1.2,-4.293; 15 2,-4.293; 16 2.8,-4.293; 25 2.8,4.293; 26 2,4.293; 27 1.2,4.293; 28 0.4,4.293; 29 -0.4,4.293; 30 -1.2,4.293; 31 -2,4.293; 32 -2.8,4.293
SOIC127P600X170-9N = smd 1.525 x 0.65: 1 -2.712,1.905; 2 -2.712,0.635; 3 -2.712,-0.635; 4 -2.712,-1.905; 5 2.712,-1.905; 6 2.712,-0.635; 7 2.712,0.635; 8 2.712,1.905 | smd 2.85 x 3.2: 9 0,0
TQFP64 = smd 1.194 x 0.559: 1 -7.76,5.905; 2 -7.76,5.118; 3 -7.76,4.331; 4 -7.76,3.543; 5 -7.76,2.756; 6 -7.76,1.968; 7 -7.76,1.181; 8 -7.76,0.394; 9 -7.76,-0.394; 10 -7.76,-1.181; 11 -7.76,-1.968; 12 -7.76,-2.756; 13 -7.76,-3.543; 14 -7.76,-4.331; 15 -7.76,-5.118; 16 -7.76,-5.905; 33 7.76,-5.905; 34 7.76,-5.118; 35 7.76,-4.331; 36 7.76,-3.543; 37 7.76,-2.756; 38 7.76,-1.968; 39 7.76,-1.181; 40 7.76,-0.394; 41 7.76,0.394; 42 7.76,1.181; 43 7.76,1.968; 44 7.76,2.756; 45 7.76,3.543; 46 7.76,4.331; 47 7.76,5.118; 48 7.76,5.905 | smd 0.559 x 1.194: 17 -5.905,-7.76; 18 -5.118,-7.76; 19 -4.331,-7.76; 20 -3.543,-7.76; 21 -2.756,-7.76; 22 -1.968,-7.76; 23 -1.181,-7.76; 24 -0.394,-7.76; 25 0.394,-7.76; 26 1.181,-7.76; 27 1.968,-7.76; 28 2.756,-7.76; 29 3.543,-7.76; 30 4.331,-7.76; 31 5.118,-7.76; 32 5.905,-7.76; 49 5.905,7.76; 50 5.118,7.76; 51 4.331,7.76; 52 3.543,7.76; 53 2.756,7.76; 54 1.968,7.76; 55 1.181,7.76; 56 0.394,7.76; 57 -0.394,7.76; 58 -1.181,7.76; 59 -1.968,7.76; 60 -2.756,7.76; 61 -3.543,7.76; 62 -4.331,7.76; 63 -5.118,7.76; 64 -5.905,7.76
SO8 = smd 0.6 x 2.2: 1 -1.905,-2.6; 2 -0.635,-2.6; 3 0.635,-2.6; 4 1.905,-2.6; 5 1.905,2.6; 6 0.635,2.6; 7 -0.635,2.6; 8 -1.905,2.6
2X05_1.27MM_SMT = smd 0.65 x 2.6: 1 -2.54,-1.85; 2 -2.54,1.85; 3 -1.27,-1.85; 4 -1.27,1.85; 5 0,-1.85; 6 0,1.85; 7 1.27,-1.85; 8 1.27,1.85; 9 2.54,-1.85; 10 2.54,1.85
SOIC127P600X175-8N = smd 1.525 x 0.65: 1 -2.712,1.905; 2 -2.712,0.635; 3 -2.712,-0.635; 4 -2.712,-1.905; 5 2.712,-1.905; 6 2.712,-0.635; 7 2.712,0.635; 8 2.712,1.905
R0603 = smd 1 x 1.1: 1 -0.85,0; 2 0.85,0
ABM3 = smd 1.9 x 2.4: 1 -2.05,0; 2 2.05,0
TO252 = smd 1 x 1.6: 1 -2.28,-4.8; 2 2.28,-4.8 | smd 5.4 x 6.2: 3 0,2.5

### Placement (x,y rotation side)
C1  18.41,57.78 315 top
C2  31.75,39.37 90 top
C3  26.04,54.61 270 top
C4  80.01,52.07 270 top
C5  26.04,71.97 270 top
C6  64.77,34.29 0 top
C7  80.01,67.31 270 top
C8  80.01,74.93 270 top
C9  27.3,38.73 270 top
C10  85.09,44.45 270 top
C11  85.09,52.07 270 top
C12  48.9,36.2 180 top
C13  53.98,36.2 180 top
C14  85.09,59.69 270 top
C15  55.88,64.77 90 top
C16  44.45,40.64 270 top
C17  83.82,30.48 0 top
C18  73.66,26.67 0 top
C19  92.71,17.78 0 top
C20  93.98,22.86 0 top
C21  8.26,53.98 0 top
C22  6.99,46.99 0 top
C23  6.99,40.64 0 top
C24  5.71,35.56 0 top
C25  5.71,26.67 0 top
C26  14.61,15.88 180 top
C27  18.41,21.59 180 top
C28  20.32,19.05 180 top
C29  20.95,5.08 180 top
C30  30.48,3.17 0 top
D1  73.03,38.1 270 top
D2  77.47,15.24 180 top
D3  62.23,11.43 0 top
D4  73.66,8.89 0 top
IC1  26.04,62.87 135 top
IC2  20.95,8.89 180 top
IC3  52.07,53.34 0 top
IC4  26.04,47.62 135 top
IC5  64.77,38.1 270 top
IC6  48.26,73.66 0 top
IC7  20.95,15.24 180 top
L1  85.09,66.04 270 top
Q1  51.44,40.01 180 top
Q2  53.34,25.4 0 top
Q3  38.1,22.86 0 top
R1  34.92,61.59 0 top
R2  90.17,62.23 270 top
R3  19.68,59.05 135 top
R4  39.37,38.1 0 top
R5  85.09,72.39 270 top
R6  28.57,71.97 270 top
R7  90.17,36.83 270 top
R8  20.95,74.93 270 top
R9  90.17,68.58 270 top
R10  95.25,53.34 270 top
R11  90.17,74.93 270 top
R12  19.05,68.58 0 top
R13  12.06,64.14 270 top
R14  95.25,41.91 270 top
R15  95.25,48.26 270 top
R16  95.25,63.5 270 top
R17  49.53,16.51 0 top
R18  54.61,15.24 180 top
R19  59.05,31.75 270 top
R20  63.5,29.21 270 top
R21  36.83,15.24 0 top
R22  38.1,11.43 0 top
R23  33.02,33.02 0 top
R24  29.21,21.59 270 top
R25  87.63,21.59 270 top
R26  87.63,26.67 0 top

### Tracks (layer width: path | path; a pad name or v marks a point on that pad's centre or on a via)
5V_REF
  Top 0.203: IC7.6 16.51,15.88 15.88,15.88 C26.1 15.46,15.46 15.24,15.24 15.24,11.43 15.88,10.79 IC2.5
!RESET  (1 unrouted)
!RST  (1 unrouted)
+UBAT  (12 unrouted)
  Top 0.203: IC7.2 21.59,14.61 21.17,15.03 C28.1 20.91,19.3 C27.+
ADC_PWR  (3 unrouted)
AGND  (10 unrouted)
AREF  (6 unrouted)
  Top 0.203: C29.1 23.5,5.08 23.67,5.25 IC2.1 27.94,6.99
AVCC  (1 unrouted)
CANH
  Top 0.203: IC5.7 71.61,38.73 D1.1
CANL
  Top 0.203: IC5.6 71.61,37.47 D1.2
DIAHD1  (1 unrouted)
DIAHD2  (1 unrouted)
DIAHG1  (2 unrouted)
DIAHG2  (2 unrouted)
GND  (via drill 0.35)
  other vias: 2.54,77.47 53.34,67.94
  pour Top: 0,80.01 100.33,80.01 100.33,0 0,0
  pour Route2: 1.27,80.01 100.33,80.01 100.33,0 0,0 0,7.62 0,80.01
H1-  (1 unrouted)
H2-  (1 unrouted)
IA1  (2 unrouted)
IA2  (2 unrouted)
IP1  (1 unrouted)
IP2  (1 unrouted)
I²C_SCL  (1 unrouted)
I²C_SDA  (1 unrouted)
MISO  (2 unrouted)
MOSI  (2 unrouted)
N$1  (2 unrouted)
N$2
  Top 0.203: IC1.3 33.79,61.66 R1.1
N$3  (2 unrouted)
N$4  (1 unrouted)
N$5
  Top 0.203: IC1.27 20.29,58.81 R3.1
N$6
  Top 0.203: IC1.26 20,59.66 R3.2 C1.1
N$7  (1 unrouted)
N$8  (2 unrouted)
N$9  (1 unrouted)
N$10  (1 unrouted)
N$11  (1 unrouted)
N$18  (1 unrouted)
N$19  (1 unrouted)
N$20  (1 unrouted)
RS1  (1 unrouted)
RS2  (1 unrouted)
RXCAN  (via drill 0.35)
  Top 0.203: IC3.31 57.19,44.41 57.78,43.81 v58.42,43.81 | IC5.4 59.69,36.2 59.05,36.83 v59.05,41.91
  Bottom 0.203: v59.05,41.91 59.05,43.18 v58.42,43.81
SCK  (2 unrouted)
TCK
  Top 0.203: IC6.1 45.72,67.94 46.35,67.31 50.16,67.31 51.68,65.8 IC3.57
TDI
  Top 0.203: IC6.9 50.8,69.85 51.44,69.22 53.34,69.22 54.04,68.52 IC3.54
TDO
  Top 0.203: IC6.3 46.99,68.58 47.62,67.94 52.07,67.94 53.25,66.76 IC3.55
TMS  (via drill 0.35)
  Top 0.203: IC6.5 48.26,69.22 48.9,68.58 v52.07,68.58 | IC3.56 52.46,66.28 v52.07,66.67
  Bottom 0.203: v52.07,68.58 v52.07,66.67
TXCAN
  Top 0.203: IC3.30 56.4,43.93 57.15,43.18 63.5,43.18 64.14,42.55 64.14,40.64 63.5,40.01 IC5.1
UA1  (2 unrouted)
UA2  (2 unrouted)
UN1  (1 unrouted)
UN2  (1 unrouted)
UP1  (3 unrouted)
UP2  (3 unrouted)
UR1  (2 unrouted)
UR2  (2 unrouted)
US1  (1 unrouted)
US2  (1 unrouted)
VBAT  (1 unrouted)
VCC  (via drill 0.35)  (9 unrouted)
  Top 0.203: IC6.4 46.99,78.11 v47.62,78.74 | C6.1 64.14,34.29 64.77,34.92 64.77,36.83 64.14,37.47 IC5.3 v60.33,37.47
  Top 0.254: C15.1 55.61,63.65 IC3.52 55.61,56.88 v52.07,53.34 49.31,50.58 IC3.21 49.31,44.23 48.26,43.18 45.72,43.18 44.45,41.91 C16.1
  other vias: 10.16,77.47
  pour Route15: 0,80.01 100.33,80.01 100.33,0 0,0
VM1  (1 unrouted)
VM2  (1 unrouted)
XTAL1
  Top 0.152: IC3.23 50.89,41.51 49.46,40.08 | 49.46,40.08 Q1.2 | C12.1 49.74,39.79 49.46,40.08
XTAL2
  Top 0.152: IC3.24 51.68,41.81 53.41,40.08 | 53.41,40.08 Q1.1 | C13.2 53.12,39.79 53.41,40.08